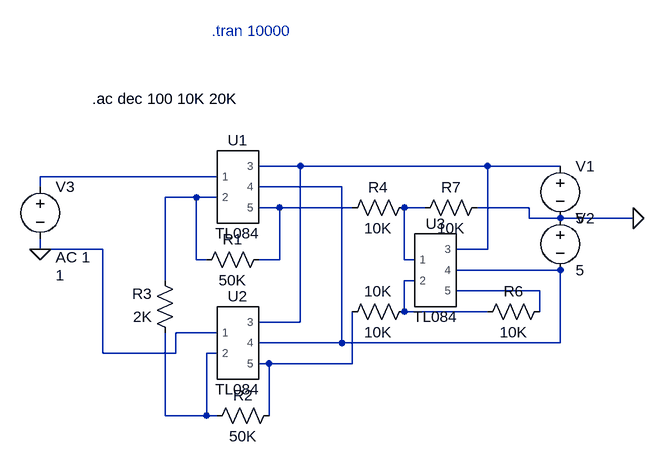
[diagram p0: schematic 实验3.asc]
实验3.asc, the LTspice schematic file:
Version 4
SHEET 1 880 680
WIRE 112 0 48 0
WIRE 400 0 112 0
WIRE 512 0 400 0
WIRE -16 16 -288 16
WIRE -288 32 -288 16
WIRE 176 32 48 32
WIRE -48 48 -96 48
WIRE -16 48 -48 48
WIRE 80 64 48 64
WIRE 192 64 80 64
WIRE 304 64 272 64
WIRE 464 64 384 64
WIRE 464 80 464 64
WIRE 512 80 464 80
WIRE 624 80 512 80
WIRE -288 128 -288 112
WIRE -192 128 -288 128
WIRE 400 128 400 0
WIRE 400 128 352 128
WIRE -48 144 -48 48
WIRE -32 144 -48 144
WIRE 80 144 80 64
WIRE 80 144 48 144
WIRE 272 144 272 64
WIRE 288 144 272 144
WIRE 512 160 352 160
WIRE -96 176 -96 48
WIRE 288 176 272 176
WIRE 480 192 352 192
WIRE 272 224 272 176
WIRE 400 224 272 224
WIRE 480 224 480 192
WIRE 112 240 112 0
WIRE 112 240 48 240
WIRE -16 256 -80 256
WIRE 176 272 176 32
WIRE 176 272 48 272
WIRE 512 272 512 160
WIRE 512 272 176 272
WIRE -192 288 -192 128
WIRE -80 288 -80 256
WIRE -80 288 -192 288
WIRE -16 288 -32 288
WIRE 64 304 48 304
WIRE 192 304 192 224
WIRE 192 304 64 304
WIRE -96 384 -96 256
WIRE -32 384 -32 288
WIRE -32 384 -96 384
WIRE -16 384 -32 384
WIRE 64 384 64 304
FLAG 624 80 0
FLAG -288 128 0
SYMBOL TL084 16 32 R0
SYMATTR InstName U1
SYMBOL TL084 16 272 R0
SYMATTR InstName U2
SYMBOL TL084 320 160 R0
SYMATTR InstName U3
SYMBOL voltage 512 -16 R0
WINDOW 123 0 0 Left 0
WINDOW 39 0 0 Left 0
SYMATTR InstName V1
SYMATTR Value 5
SYMBOL voltage 512 64 R0
WINDOW 123 0 0 Left 0
WINDOW 39 0 0 Left 0
SYMATTR InstName V2
SYMATTR Value 5
SYMBOL res 64 128 R90
WINDOW 0 0 56 VBottom 2
WINDOW 3 32 56 VTop 2
SYMATTR InstName R1
SYMATTR Value 50K
SYMBOL res 80 368 R90
WINDOW 0 0 56 VBottom 2
WINDOW 3 32 56 VTop 2
SYMATTR InstName R2
SYMATTR Value 50K
SYMBOL res -80 272 R180
WINDOW 0 36 76 Left 2
WINDOW 3 36 40 Left 2
SYMATTR InstName R3
SYMATTR Value 2K
SYMBOL res 176 80 R270
WINDOW 0 32 56 VTop 2
WINDOW 3 0 56 VBottom 2
SYMATTR InstName R4
SYMATTR Value 10K
SYMBOL res 176 240 R270
WINDOW 0 32 56 VTop 2
WINDOW 3 0 56 VBottom 2
SYMATTR InstName 10K
SYMATTR Value 10K
SYMBOL res 384 240 R270
WINDOW 0 32 56 VTop 2
WINDOW 3 0 56 VBottom 2
SYMATTR InstName R6
SYMATTR Value 10K
SYMBOL res 288 80 R270
WINDOW 0 32 56 VTop 2
WINDOW 3 0 56 VBottom 2
SYMATTR InstName R7
SYMATTR Value 10K
SYMBOL voltage -288 16 R0
WINDOW 3 24 152 Left 2
WINDOW 123 24 124 Left 2
WINDOW 39 0 0 Left 0
SYMATTR InstName V3
SYMATTR Value 1
SYMATTR Value2 AC 1
TEXT -24 -208 Left 2 ;.tran 10000
TEXT -208 -104 Left 2 !.ac dec 100 10K 20K

The netlist it stands for:
* 实验3.asc
XU1 N002 N004 N001 N003 N005 TL084  ; pins 1 2 3 4 5
XU2 0 N009 N001 N003 N010 TL084  ; pins 1 2 3 4 5
XU3 N006 N007 N001 N003 N008 TL084  ; pins 1 2 3 4 5
V1 N001 0 5
V2 0 N003 5
R1 N005 N004 50K
R2 N010 N009 50K
R3 N009 N004 2K
R4 N005 N006 10K
R§10K N010 N007 10K
R6 N007 N008 10K
R7 N006 0 10K
V3 N002 0 1 AC 1
* .tran 10000
.ac dec 100 10K 20K
.lib C:\Users\Aristotle\Documents\LTspice\TL084.301
.backanno
.end